# Altium schematic sheet IO_Combo_WiFi.SchDoc: WiFi Module
size Tabloid; Date: 09/21/2024; Engineer: Terry D. Schevker; Revision: 1.0; SheetNumber: 5; SheetTotal: 5
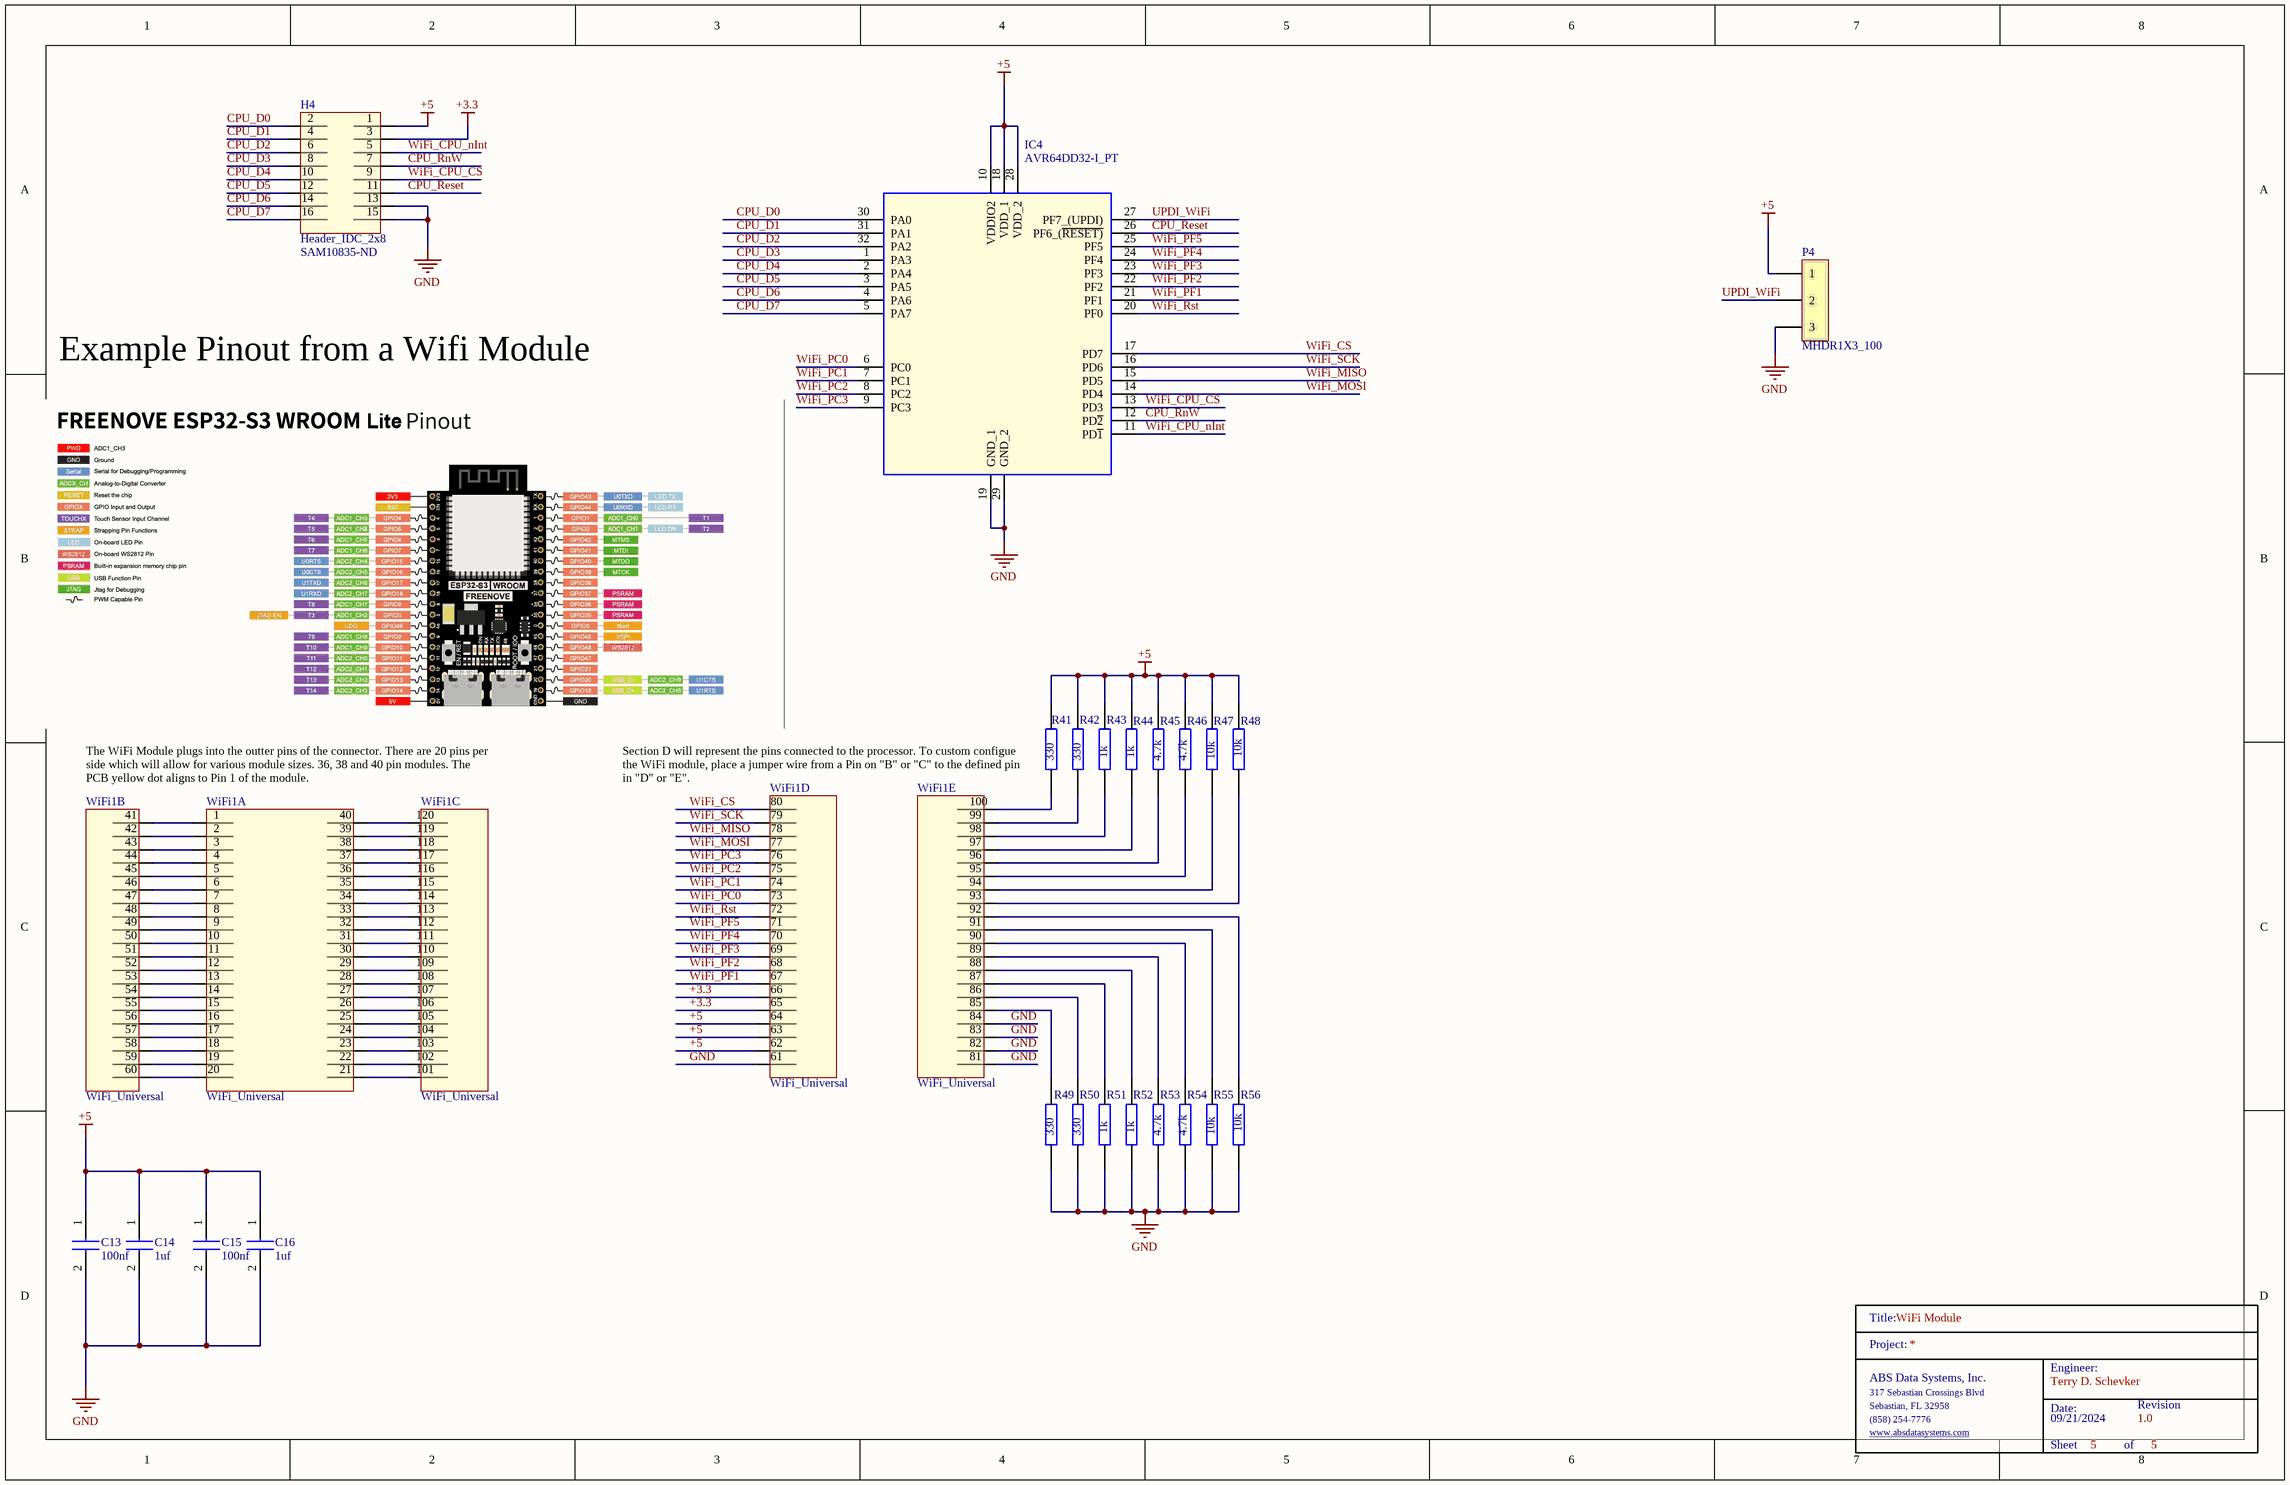
[diagram p0: IO_Combo_WiFi.SchDoc]

## Parts
C13  100nf  [0603]
C14  1uf  [0603]
C15  100nf  [0603]
C16  1uf  [0603]
H4  Header_IDC_2x8  Supplier Part Number 1: SAM10835-ND  [HEADER16]
IC4  AVR64DD32-I_PT  [QFP80P900X900X120-32N]
P4  MHDR1X3_100  [MHDR1X3_100]
R41  330  [0603]
R42  330  [0603]
R43  1k  [0603]
R44  1k  [0603]
R45  4.7k  [0603]
R46  4.7k  [0603]
R47  10k  [0603]
R48  10k  [0603]
R49  330  [0603]
R50  330  [0603]
R51  1k  [0603]
R52  1k  [0603]
R53  4.7k  [0603]
R54  4.7k  [0603]
R55  10k  [0603]
R56  10k  [0603]
TitleBlock_1  TitleBlock  (value not drawn)  (graphical)
WiFi1  WiFi_Universal  [WiFI_Universal]  (parts A,B,C,D,E of 5)

## Nets
+3.3: H4.3 WiFi1.65 WiFi1.66
+5: C13.1 C14.1 C15.1 C16.1 H4.1 IC4.10(VDDIO2) IC4.18(VDD_1) IC4.28(VDD_2) P4.1 R41.1 R42.1 R43.1 R44.1 R45.1 R46.1 R47.1 R48.1 WiFi1.62 WiFi1.63 WiFi1.64
GND: C13.2 C14.2 C15.2 C16.2 H4.13 H4.15 IC4.19(GND_1) IC4.29(GND_2) P4.3 R49.2 R50.2 R51.2 R52.2 R53.2 R54.2 R55.2 R56.2 WiFi1.61 WiFi1.81 WiFi1.82 WiFi1.83 WiFi1.84
CPU_D0: H4.2 IC4.30(PA0)
CPU_D1: H4.4 IC4.31(PA1)
CPU_D2: H4.6 IC4.32(PA2)
CPU_D3: H4.8 IC4.1(PA3)
CPU_D4: H4.10 IC4.2(PA4)
CPU_D5: H4.12 IC4.3(PA5)
CPU_D6: H4.14 IC4.4(PA6)
CPU_D7: H4.16 IC4.5(PA7)
CPU_Reset: H4.11 IC4.26(PF6_(~{RESET)})
CPU_RnW: H4.7 IC4.12(PD~{2})
UPDI_WiFi: IC4.27(PF7_(UPDI)) P4.2
WiFi_CPU_CS: H4.9 IC4.13(PD3)
WiFi_CPU_nInt: H4.5 IC4.11(PD~{1})
WiFi_CS: IC4.17(PD7) WiFi1.80
WiFi_MISO: IC4.15(PD5) WiFi1.78
WiFi_MOSI: IC4.14(PD4) WiFi1.77
WiFi_PC0: IC4.6(PC0) WiFi1.73
WiFi_PC1: IC4.7(PC1) WiFi1.74
WiFi_PC2: IC4.8(PC2) WiFi1.75
WiFi_PC3: IC4.9(PC3) WiFi1.76
WiFi_PF1: IC4.21(PF1) WiFi1.67
WiFi_PF2: IC4.22(PF2) WiFi1.68
WiFi_PF3: IC4.23(PF3) WiFi1.69
WiFi_PF4: IC4.24(PF4) WiFi1.70
WiFi_PF5: IC4.25(PF5) WiFi1.71
WiFi_Rst: IC4.20(PF0) WiFi1.72
WiFi_SCK: IC4.16(PD6) WiFi1.79
NetR41_2: R41.2 WiFi1.100
NetR42_2: R42.2 WiFi1.99
NetR43_2: R43.2 WiFi1.98
NetR44_2: R44.2 WiFi1.97
NetR45_2: R45.2 WiFi1.96
NetR46_2: R46.2 WiFi1.95
NetR47_2: R47.2 WiFi1.94
NetR48_2: R48.2 WiFi1.93
NetR49_1: R49.1 WiFi1.85
NetR50_1: R50.1 WiFi1.86
NetR51_1: R51.1 WiFi1.87
NetR52_1: R52.1 WiFi1.88
NetR53_1: R53.1 WiFi1.89
NetR54_1: R54.1 WiFi1.90
NetR55_1: R55.1 WiFi1.91
NetR56_1: R56.1 WiFi1.92
NetWiFi1_1: WiFi1.1 WiFi1.41
NetWiFi1_2: WiFi1.2 WiFi1.42
NetWiFi1_3: WiFi1.3 WiFi1.43
NetWiFi1_4: WiFi1.4 WiFi1.44
NetWiFi1_5: WiFi1.5 WiFi1.45
NetWiFi1_6: WiFi1.6 WiFi1.46
NetWiFi1_7: WiFi1.7 WiFi1.47
NetWiFi1_8: WiFi1.8 WiFi1.48
NetWiFi1_9: WiFi1.9 WiFi1.49
NetWiFi1_10: WiFi1.10 WiFi1.50
NetWiFi1_11: WiFi1.11 WiFi1.51
NetWiFi1_12: WiFi1.12 WiFi1.52
NetWiFi1_13: WiFi1.13 WiFi1.53
NetWiFi1_14: WiFi1.14 WiFi1.54
NetWiFi1_15: WiFi1.15 WiFi1.55
NetWiFi1_16: WiFi1.16 WiFi1.56
NetWiFi1_17: WiFi1.17 WiFi1.57
NetWiFi1_18: WiFi1.18 WiFi1.58
NetWiFi1_19: WiFi1.19 WiFi1.59
NetWiFi1_20: WiFi1.20 WiFi1.60
NetWiFi1_21: WiFi1.21 WiFi1.101
NetWiFi1_22: WiFi1.22 WiFi1.102
NetWiFi1_23: WiFi1.23 WiFi1.103
NetWiFi1_24: WiFi1.24 WiFi1.104
NetWiFi1_25: WiFi1.25 WiFi1.105
NetWiFi1_26: WiFi1.26 WiFi1.106
NetWiFi1_27: WiFi1.27 WiFi1.107
NetWiFi1_28: WiFi1.28 WiFi1.108
NetWiFi1_29: WiFi1.29 WiFi1.109
NetWiFi1_30: WiFi1.30 WiFi1.110
NetWiFi1_31: WiFi1.31 WiFi1.111
NetWiFi1_32: WiFi1.32 WiFi1.112
NetWiFi1_33: WiFi1.33 WiFi1.113
NetWiFi1_34: WiFi1.34 WiFi1.114
NetWiFi1_35: WiFi1.35 WiFi1.115
NetWiFi1_36: WiFi1.36 WiFi1.116
NetWiFi1_37: WiFi1.37 WiFi1.117
NetWiFi1_38: WiFi1.38 WiFi1.118
NetWiFi1_39: WiFi1.39 WiFi1.119
NetWiFi1_40: WiFi1.40 WiFi1.120

## Notes on the sheet
- Example Pinout from a Wifi Module
- (near WiFi1) The WiFi Module plugs into the outter pins of the connector. There are 20 pins per side which will allow for various module sizes. 36, 38 and 40 pin modules. The PCB yellow dot aligns to Pin 1 of the module.
- Section D will represent the pins connected to the processor. To custom configue the WiFi module, place a jumper wire from a Pin on "B" or "C" to the defined pin in "D" or "E".
- (in symbol TitleBlock) Title:; Project:; Engineer:; ABS Data Systems, Inc.; 317 Sebastian Crossings Blvd; Sebastian, FL 32958; Date:; Revision; (858) 254-7776; www.absdatasystems.com; Sheet; of

## Library data of the parts
C13 C15 = CL10B104JB8NNNC: Samsung Electro-Mechanics 0603 100nf
C14 C16 = CL10B105KA8NNNL: Samsung Electro-Mechanics 0603 1uf
H4 = Header_IDC_2x8: 16 Pin 2x8 Through Hold IDC Connector; Manufacturer: Samtec; Manufacturer Part Number: TST-108-01-G-D; Number of Contacts: 16; Gender: Male; Connector Type: Male Pin; Pitch: 2.54mm; Row Spacing: 0.1inch; Supplier 1: Digi-Key; RoHS: Yes; Category: Headers and Wire Housings; Stock 1: 227; Pricing 1: 1=2.85000, 10=2.73600, 100=2.28000, 500=1.93800, 1000=1.65300, 5000=1.48200 (USD); Mount: Through Hole; Contact Plating: Gold; Contact Material: Bronze; Housing Material: Polyester; Housing Color: Black; Color: Black; Min Operating Temperature: -55°C; Max Operating Temperature: 125°C; Number of Rows: 2; Termination: Solder; Packaging: Rail/Tube; Orientation: Straight; Number of Positions: 16; Length: 27.94mm; Depth: 9.27mm; Contact Mating Length: 0.25inch; REACH SVHC: No SVHC; ComponentLink1URL: https://datasheet.ciiva.com/739/tst-mkt-739845.pdf?src-supplier=Digi-Key; ComponentLink1Description: https://datasheet.ciiva.com/739/tst-mkt-739845.pdf?src-supplier=Digi-Key; ComponentLink2URL: https://datasheet.ciiva.com/10018/htst-10018510.pdf?src-supplier=Avnet; ComponentLink2Description: https://datasheet.ciiva.com/10018/htst-10018510.pdf?src-supplier=Avnet
IC4 = AVR64DD32-I_PT: Integrated Circuit; Manufacturer_Name: Microchip; Manufacturer_Part_Number: AVR64DD32-I/PT | MULTI-VOLTAGE I/O; Datasheet Link: https://www.microchip.com/en-us/product/AVR64DD32; Height: 1.2mm
P4 = MHDR1X3_100: Header, 3-Pin; LatestRevisionDate: 17-Jul-2002; LatestRevisionNote: Re-released for DXP Platform.; Publisher: Altium Limited
R41 R42 R49 R50 = AC0603FR-10330RL: YAGEO 0603 330 ohm; Manufacturer_Name: KEMET; Manufacturer_Part_Number: RC0603JR-070RL; Geometry.Height: 0.55mm; Mouser Part Number: 603-RC0603JR-070RL; Mouser Price/Stock: https://www.mouser.co.uk/ProductDetail/YAGEO/RC0603JR-070RL?qs=2cAdsCoAWRGWyPcuXgGiXQ%3D%3D; Datasheet Link: https://datasheet.datasheetarchive.com/originals/distributors/Datasheets_SAMA/902f9e387b938f871d31120f5fc1d65e.pdf
R43 R44 R51 R52 = AC0603FR-7W1KL_1: YAGEO 0603 1k ohm; Manufacturer_Name: KEMET; Manufacturer_Part_Number: RC0603JR-070RL; Geometry.Height: 0.55mm; Mouser Part Number: 603-RC0603JR-070RL; Mouser Price/Stock: https://www.mouser.co.uk/ProductDetail/YAGEO/RC0603JR-070RL?qs=2cAdsCoAWRGWyPcuXgGiXQ%3D%3D; Datasheet Link: https://datasheet.datasheetarchive.com/originals/distributors/Datasheets_SAMA/902f9e387b938f871d31120f5fc1d65e.pdf
R45 R46 R53 R54 = RC0603FR-104K7L: YAGEO 0603 4.7k; Manufacturer_Name: KEMET; Manufacturer_Part_Number: RC0603JR-070RL; Geometry.Height: 0.55mm; Mouser Part Number: 603-RC0603JR-070RL; Mouser Price/Stock: https://www.mouser.co.uk/ProductDetail/YAGEO/RC0603JR-070RL?qs=2cAdsCoAWRGWyPcuXgGiXQ%3D%3D; Datasheet Link: https://datasheet.datasheetarchive.com/originals/distributors/Datasheets_SAMA/902f9e387b938f871d31120f5fc1d65e.pdf
R47 R48 R55 R56 = RC0603JR-0710KL: YAGEO 0603 10k ohm; Manufacturer_Name: KEMET; Manufacturer_Part_Number: RC0603JR-070RL; Geometry.Height: 0.55mm; Mouser Part Number: 603-RC0603JR-070RL; Mouser Price/Stock: https://www.mouser.co.uk/ProductDetail/YAGEO/RC0603JR-070RL?qs=2cAdsCoAWRGWyPcuXgGiXQ%3D%3D; Datasheet Link: https://datasheet.datasheetarchive.com/originals/distributors/Datasheets_SAMA/902f9e387b938f871d31120f5fc1d65e.pdf